# Altium schematic sheet REVERSE_POLARITY_PROT.SchDoc: =DocumentName
size A4; CompanyName: "AS Manufacturing" LLC; Organization: "AS Manufacturing" LLC; Address1: 5 Sklyarenka St.; Address2: Kyiv 04073; Address3: Ukraine; Address4: https://ajax.systems/en/; SheetNumber: 5; SheetTotal: 8; Template_version: 1.0.1
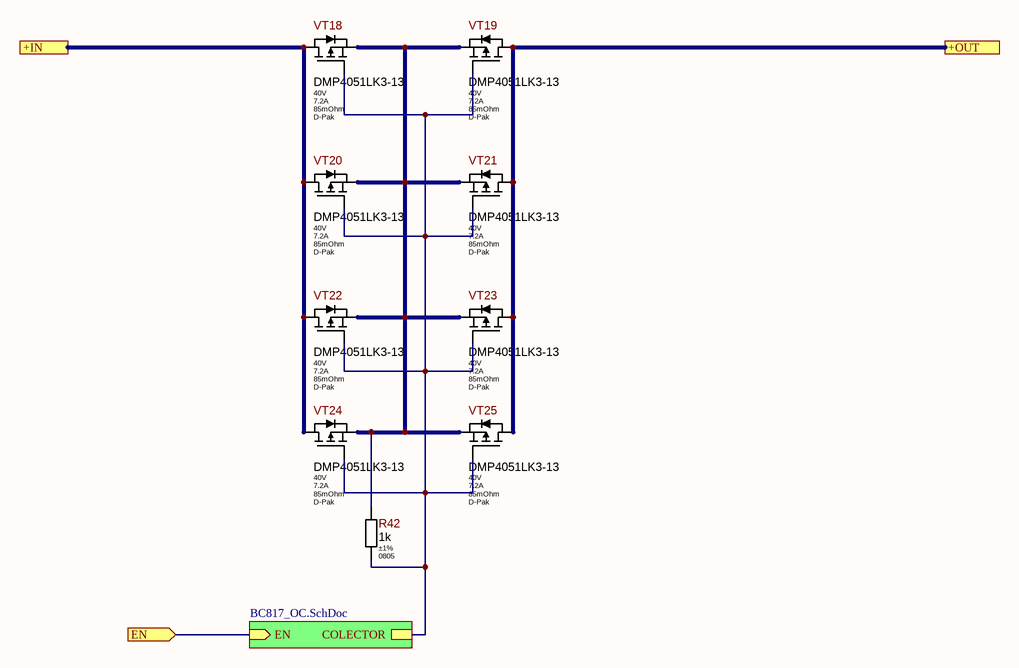
[diagram p0: REVERSE_POLARITY_PROT.SchDoc]

## Parts
R42  Tolerance: ±1%  Package: 0805  [R_ANY_CHIP_0805_MED]  (hidden comment: 1k)
VT18  Vds: 40V  Id: 7.2A  Rds: 85mOhm  Package: D-Pak  [DPAK_REC]  (hidden comment: DMP4051LK3-13)
VT19  Vds: 40V  Id: 7.2A  Rds: 85mOhm  Package: D-Pak  [DPAK_REC]  (hidden comment: DMP4051LK3-13)
VT20  Vds: 40V  Id: 7.2A  Rds: 85mOhm  Package: D-Pak  [DPAK_REC]  (hidden comment: DMP4051LK3-13)
VT21  Vds: 40V  Id: 7.2A  Rds: 85mOhm  Package: D-Pak  [DPAK_REC]  (hidden comment: DMP4051LK3-13)
VT22  Vds: 40V  Id: 7.2A  Rds: 85mOhm  Package: D-Pak  [DPAK_REC]  (hidden comment: DMP4051LK3-13)
VT23  Vds: 40V  Id: 7.2A  Rds: 85mOhm  Package: D-Pak  [DPAK_REC]  (hidden comment: DMP4051LK3-13)
VT24  Vds: 40V  Id: 7.2A  Rds: 85mOhm  Package: D-Pak  [DPAK_REC]  (hidden comment: DMP4051LK3-13)
VT25  Vds: 40V  Id: 7.2A  Rds: 85mOhm  Package: D-Pak  [DPAK_REC]  (hidden comment: DMP4051LK3-13)

## Sub-sheets
OC = BC817_OC.SchDoc: EN (in), COLECTOR

## Ports
+IN, +OUT, EN (in)

## Nets
+IN: VT18.2(D) VT20.2(D) VT22.2(D) VT24.2(D) ; port +IN
+OUT: VT19.2(D) VT21.2(D) VT23.2(D) VT25.2(D) ; port +OUT
EN: port EN, sheet OC/EN
NetR42_1: R42.1 VT18.1(G) VT19.1(G) VT20.1(G) VT21.1(G) VT22.1(G) VT23.1(G) VT24.1(G) VT25.1(G) ; sheet OC/COLECTOR
NetR42_2: R42.2 VT18.3(S) VT19.3(S) VT20.3(S) VT21.3(S) VT22.3(S) VT23.3(S) VT24.3(S) VT25.3(S)

## Notes on the sheet
- Title
- Product:
- Project:
- Size:
- Date:
- Variant:
- A4
- Authors:
- Time:
- Sheet
- of
- Revision:
- @Vitech_ua
- Commit:

## Library data of the parts
R42 = RC0805FR-071KL: 1 kOhms ±1%, 1/8W 0805 Thick Film Resistor; Manufacturer: Yageo; Ajax_1C_ID: 8520; Ajax_1C_PN: 1k 1% 0805 Resistors SMD RoHS; Ajax_1С_Status: Mass Production; Power Rating: 0.125W; Voltage: 150V; Component Status: Released; Temperature Stability: ±100ppm/°C; Replacement: NONE; GUID_1C: 0c53a8ec-2890-11e6-81ae-d8cb8a9acc66; Value: 1k; Part Number: RC0805FR-071KL; Component Type: SMD; Part Type: Thick Film; Temperature Range: -55°C ~ 155°C; ComponentLink1URL: https://eu.mouser.com/datasheet/2/447/PYu_RC_Group_51_RoHS_L_10-1664068.pdf; Supplier 1: Digi-Key; Supplier Part Number 1: 311-1.00KCRTR-ND; Price: 0,0014; ComponentLink1Description: Datasheet
VT18-VT25 = DMP4051LK3-13: -40V, -7.2A max P-Channel Enhancement MOSFET, 59mOhm @ Vgs = -4.5V; Manufacturer: Diodes Incorporated; Ajax_1C_ID: 18605; Ajax_1C_PN: DMP4051LK3 40V, 0,05Ohm P-chanel Power HEXFET; Ajax_1С_Status: Mass Production; Component Status: Released; Standard Lead Time: 30 Weeks; Replacement: NONE; GUID_1C: 9abe91dd-36a9-11ea-ab5a-0050569f2651; Part Number: DMP4051LK3-13; Part Type: P-Channel; Component Type: SMD; Temperature Range: -55°C ~ 150°C; ComponentLink1URL: https://www.diodes.com/assets/Datasheets/DMP4051LK3.pdf; Supplier 1: Digi-Key; Supplier Part Number 1: DMP4051LK3-13DITR-ND; Price: 0,1628; ComponentLink1Description: Datasheet